# EAGLE design digitalcontrol (EAGLE 7.4.0)
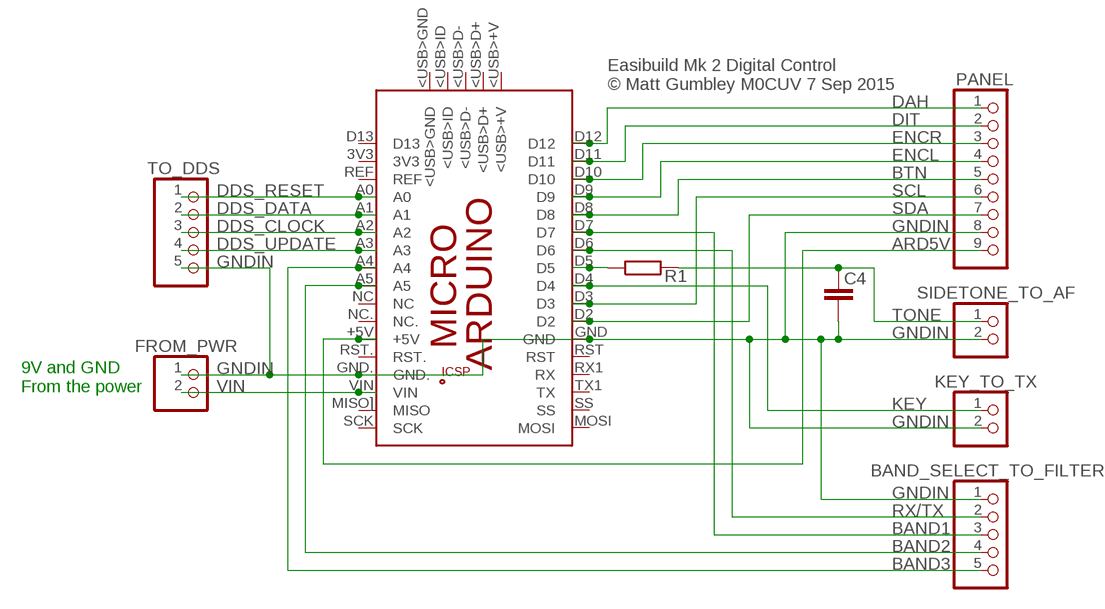
[diagram p0: schematic, sheet 1]

## Parts
BAND_SELECT_TO_FILTERS  PINHD-1X5  [1X05]
C4  C-EU050-025X075  [C050-025X075]
FROM_PWR  PINHD-1X2  [1X02]
KEY_TO_TX  PINHD-1X2  [1X02]
PANEL  PINHD-1X9  [1X09]
PCB1  ARDUINO_MICRO  [ARDUINO_MICRO]
R1  R-EU_0204/5  [0204/5]
SIDETONE_TO_AF  PINHD-1X2  [1X02]
TO_DDS  PINHD-1X5  [1X05]

## Nets
ARD5V: PANEL.9 PCB1.+5V
BAND1: BAND_SELECT_TO_FILTERS.3 PCB1.D7
BAND2: BAND_SELECT_TO_FILTERS.4 PCB1.A5
BAND3: BAND_SELECT_TO_FILTERS.5 PCB1.A4
BTN: PANEL.5 PCB1.D8
DAH: PANEL.1 PCB1.D12
DDS_CLOCK: PCB1.A2 TO_DDS.3
DDS_DATA: PCB1.A1 TO_DDS.2
DDS_RESET: PCB1.A0 TO_DDS.1
DDS_UPDATE: PCB1.A3 TO_DDS.4
DIT: PANEL.2 PCB1.D11
ENCL: PANEL.4 PCB1.D9
ENCR: PANEL.3 PCB1.D10
GNDIN: BAND_SELECT_TO_FILTERS.1 C4.2 FROM_PWR.1 KEY_TO_TX.2 PANEL.8 PCB1.GND PCB1.GND. SIDETONE_TO_AF.2 TO_DDS.5
KEY: KEY_TO_TX.1 PCB1.D4
N$1: PCB1.D5 R1.1
RX/TX: BAND_SELECT_TO_FILTERS.2 PCB1.D6
SCL: PANEL.6 PCB1.D3
SDA: PANEL.7 PCB1.D2
TONE: C4.1 R1.2 SIDETONE_TO_AF.1
VIN: FROM_PWR.2 PCB1.VIN
Unconnected: PCB1.3V3 PCB1.5V PCB1.<USB>+V PCB1.<USB>D+ PCB1.<USB>D- PCB1.<USB>GND PCB1.<USB>ID PCB1.D13 PCB1.GND_ PCB1.MISO. PCB1.MISO](MISO) PCB1.MOSI PCB1.MOSI. PCB1.NC PCB1.NC. PCB1.REF PCB1.RESET.. PCB1.RST PCB1.RST. PCB1.RX1(RX) PCB1.SCK PCB1.SCK. PCB1.SS PCB1.TX1(TX)

## Notes on the sheet
- Easibuild Mk 2 Digital Control
  © Matt Gumbley M0CUV 7 Sep 2015
- 9V and GND
  From the power

## Library data of the parts
BAND_SELECT_TO_FILTERS TO_DDS = pinhead:PINHD-1X5: PIN HEADER
C4 = resistor:C-EU: CAPACITOR, European symbol
FROM_PWR KEY_TO_TX SIDETONE_TO_AF = pinhead:PINHD-1X2: PIN HEADER
PANEL = pinhead:PINHD-1X9: PIN HEADER
PCB1 = E14_Arduino_revB:ARDUINO_MICRO: Device for representing an Arduino Micro board with a footprint in an EAGLE design. Created by Dave Young for Element14. More EAGLE documentation at: http://www.element14.com/community/community/knode/cadsoft_eagle
R1 = resistor:R-EU_: RESISTOR, European symbol

## Board
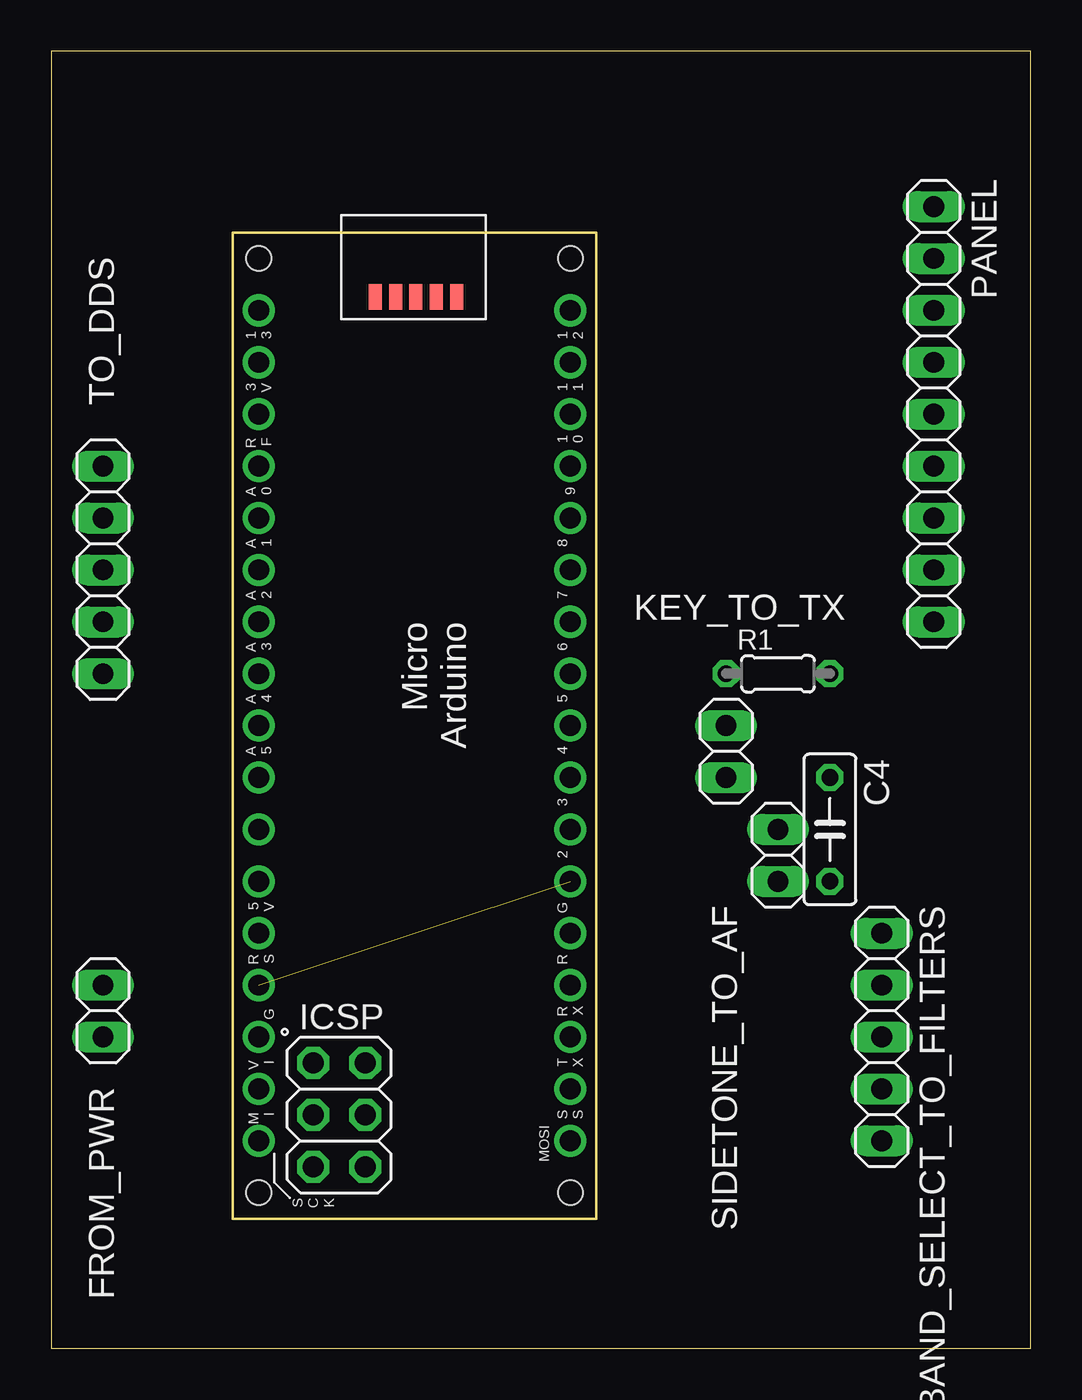
[diagram p1: board, top side]
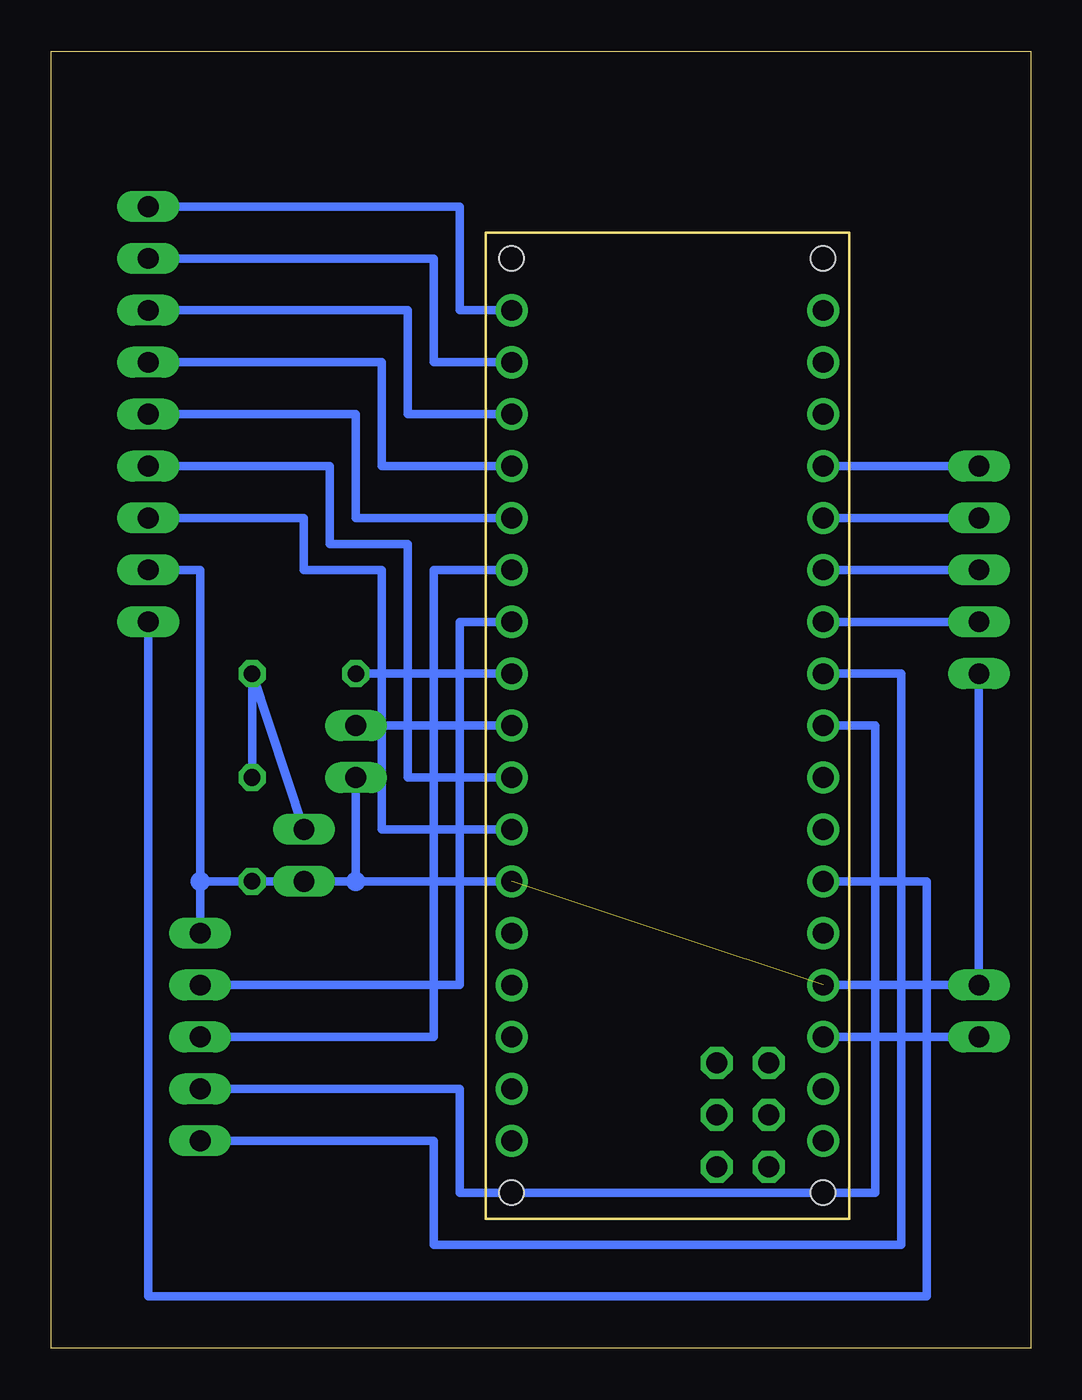
[diagram p2: board, bottom side, seen from below]

Size 47.93 x 63.49 mm. Coordinates in mm from the lower left corner, seen from the top.
Outline: 0,0 47.93,0 47.93,63.49 0,63.49 0,0
Copper layers 1: Top 0.035mm
Design rules "default *": minimum track width 10mil, minimum drill 24mil, track to track 8mil, track to pad 8mil, pad to pad 8mil, via to via 8mil, smd to smd 8mil, copper to edge 40mil, drill to drill 8mil, minimum pad ring 10mil, minimum via ring 8mil, stop-mask expansion 4mil, vias tented up to drill 0mil, thermal gap 10mil

### Footprints (pad centres in the part's own frame; a part is rotated, then mirrored left to right if it is on the bottom)
1X05 = drill 1.016 long: 1 -5.08,0; 2 -2.54,0; 3 0,0; 4 2.54,0; 5 5.08,0
C050-025X075 = drill 0.813 octagon: 1 -2.54,0; 2 2.54,0
1X02 = drill 1.016 long: 1 -1.27,0; 2 1.27,0
1X09 = drill 1.016 long: 1 -10.16,0; 2 -7.62,0; 3 -5.08,0; 4 -2.54,0; 5 0,0; 6 2.54,0; 7 5.08,0; 8 7.62,0; 9 10.16,0
ARDUINO_MICRO = drill 1.016 pad 1.575: 3V3 6.35,1.27; +5V 31.75,1.27; A0 11.43,1.27; A1 13.97,1.27; A2 16.51,1.27; A3 19.05,1.27; A4 21.59,1.27; A5 24.13,1.27; D2 29.21,16.51; D3 26.67,16.51; D4 24.13,16.51; D5 21.59,16.51; D6 19.05,16.51; D7 16.51,16.51; D8 13.97,16.51; D9 11.43,16.51; D10 8.89,16.51; D11 6.35,16.51; D12 3.81,16.51; D13 3.81,1.27; GND 31.75,16.51; GND. 36.83,1.27; MISO] 41.91,1.27; MOSI 44.45,16.51; NC 26.67,1.27; NC. 29.21,1.27; REF 8.89,1.27; RST 34.29,16.51; RST. 34.29,1.27; RX1 36.83,16.51; SCK 44.45,1.27; SS 41.91,16.51; TX1 39.37,16.51; VIN 39.37,1.27 | drill 1.016 pad 1.575 octagon: 5V 40.64,6.477; GND_ 45.72,6.477; MISO. 40.64,3.937; MOSI. 43.18,6.477; RESET.. 45.72,3.937; SCK. 43.18,3.937 | smd 1.27 x 0.635: <USB>+V 3.15,10.947; <USB>D+ 3.15,9.957; <USB>D- 3.15,8.941; <USB>GND 3.15,6.96; <USB>ID 3.15,7.976 | hole 1.2: 1.27,1.27; 1.27,16.51; 46.99,16.51; 46.99,1.27
0204/5 = drill 0.813 octagon: 1 -2.54,0; 2 2.54,0

### Placement (x,y rotation side)
BAND_SELECT_TO_FILTERS  40.64,15.24 270 top
C4  38.1,25.4 270 top
FROM_PWR  2.54,16.51 270 top
KEY_TO_TX  33.02,29.21 270 top
PANEL  43.18,45.72 270 top
PCB1  8.89,54.61 270 top
R1  35.56,33.02 0 top
SIDETONE_TO_AF  35.56,24.13 270 top
TO_DDS  2.54,38.1 270 top

### Tracks (layer width: path | path; a pad name or v marks a point on that pad's centre or on a via)
ARD5V
  Bottom 0.406: PCB1.+5V 5.08,22.86 5.08,2.54 43.18,2.54 PANEL.9
BAND1
  Bottom 0.406: PCB1.D7 29.21,38.1 29.21,15.24 BAND_SELECT_TO_FILTERS.3
BAND2
  Bottom 0.406: PCB1.A5 7.62,30.48 7.62,7.62 27.94,7.62 27.94,12.7 BAND_SELECT_TO_FILTERS.4
BAND3
  Bottom 0.406: PCB1.A4 6.35,33.02 6.35,5.08 29.21,5.08 29.21,10.16 BAND_SELECT_TO_FILTERS.5
BTN
  Bottom 0.406: PANEL.5 33.02,45.72 33.02,40.64 PCB1.D8
DAH
  Bottom 0.406: PANEL.1 27.94,55.88 27.94,50.8 PCB1.D12
DDS_CLOCK
  Bottom 0.406: TO_DDS.3 PCB1.A2
DDS_DATA
  Bottom 0.406: TO_DDS.2 PCB1.A1
DDS_RESET
  Bottom 0.406: TO_DDS.1 PCB1.A0
DDS_UPDATE
  Bottom 0.406: TO_DDS.4 PCB1.A3
DIT
  Bottom 0.406: PCB1.D11 29.21,48.26 29.21,53.34 PANEL.2
ENCL
  Bottom 0.406: PCB1.D9 31.75,43.18 31.75,48.26 PANEL.4
ENCR
  Bottom 0.406: PANEL.3 30.48,50.8 30.48,45.72 PCB1.D10
GNDIN  (1 unrouted)
  Bottom 0.406: PCB1.GND 33.02,22.86 | 33.02,22.86 SIDETONE_TO_AF.2 | 40.64,22.86 SIDETONE_TO_AF.2 | BAND_SELECT_TO_FILTERS.1 40.64,22.86 | PCB1.GND. FROM_PWR.1 TO_DDS.5 | KEY_TO_TX.2 33.02,22.86 | PANEL.8 40.64,38.1 40.64,22.86 | SIDETONE_TO_AF.2 C4.2
KEY
  Bottom 0.406: KEY_TO_TX.1 PCB1.D4
N$1
  Bottom 0.406: PCB1.D5 R1.1
RX/TX
  Bottom 0.406: PCB1.D6 27.94,35.56 27.94,17.78 BAND_SELECT_TO_FILTERS.2
SCL
  Bottom 0.406: PANEL.6 34.29,43.18 34.29,39.37 30.48,39.37 30.48,27.94 PCB1.D3
SDA
  Bottom 0.406: PANEL.7 35.56,40.64 35.56,38.1 31.75,38.1 31.75,25.4 PCB1.D2
TONE
  Bottom 0.406: C4.1 R1.2 SIDETONE_TO_AF.1
VIN
  Bottom 0.406: FROM_PWR.2 PCB1.VIN
(copper drawn outside any net)
  shapes: Bottom circle x2

### Text on the board
Document: Easibuild Mk 2 Digital Control / © Matt Gumbley M0CUV 7 Sep 2015